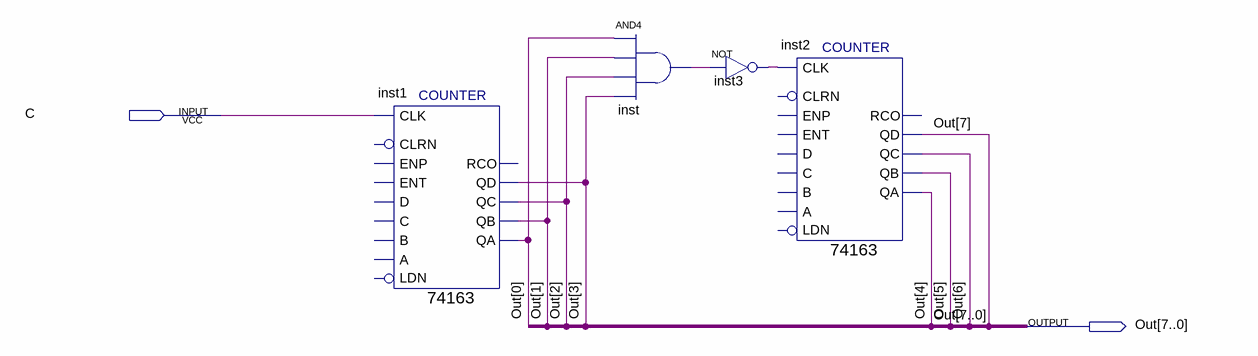
[diagram p0: schematic sheet]
// Quartus schematic Counter8.bdf as structural Verilog: 4 symbols, 2 pins
module Counter8 (
  input  C,
  output [7:0] Out
);

  wire inst3_out, inst_out;

  \74163  inst1 (
    .CLK(C), .QA(Out[0]), .QB(Out[1]), .QC(Out[2]), .QD(Out[3]));  // open: C, B, A, ENT, D, CLRN, ENP, LDN, RCO
  and inst (inst_out, Out[0], Out[1], Out[2], Out[3]);
  not inst3 (inst3_out, inst_out);
  \74163  inst2 (
    .CLK(inst3_out), .QA(Out[4]), .QB(Out[5]), .QC(Out[6]), .QD(Out[7]));  // open: C, B, A, ENT, D, CLRN, ENP, LDN, RCO
endmodule
